# EAGLE design control_board-mixed (EAGLE 8.3.1)
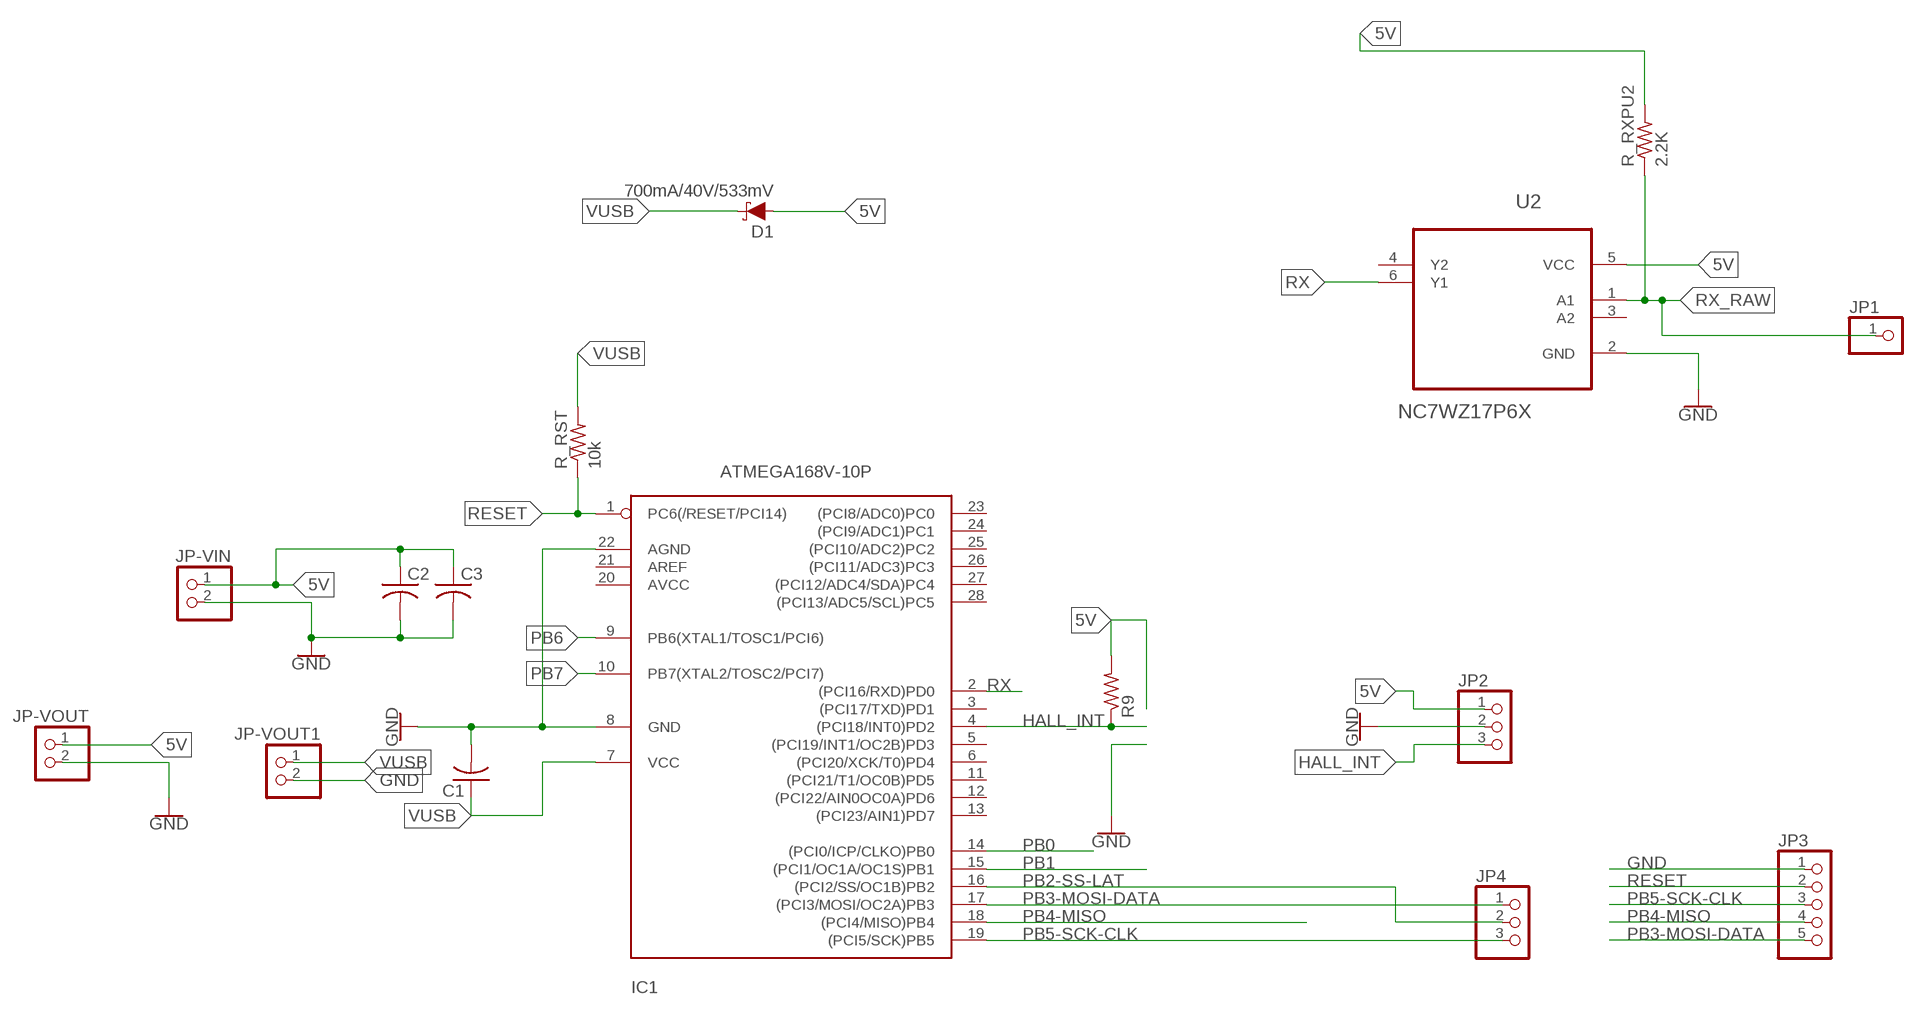
[diagram p0: schematic, sheet 1]

## Parts
C1  C-US025-030X050  [C025-030X050]
C2  C-US025-060X050  [C025-060X050]
C3  C-US025-060X050  [C025-060X050]
D1  700mA/40V/533mV  DIODE-SCHOTTKY-ZLLS500  [SOT23-3]
IC1  ATMEGA168V-10P  [DIL28-3]
JP1  PINHD-1X1  [1X01]
JP2  PINHD-1X3  [1X03]
JP3  PINHD-1X5  [1X05]
JP4  PINHD-1X3  [1X03]
JP-VIN  PINHD-1X2  [1X02]
JP-VOUT  PINHD-1X2  [1X02]
JP-VOUT1  PINHD-1X2  [1X02]
R9  R-US_0207/7  [0207/7]
R_RST  10k  R-US_R0603  [R0603]
R_RXPU2  2.2K  R-US_R0603  [R0603]
U2  NC7WZ17P6X  [SOT65P210X110-6N]

## Nets
5V: C2.1 C3.1 D1.1(A) JP2.1 JP-VIN.1 JP-VOUT.1 R9.2 R_RXPU2.2 U2.5(VCC)
GND: C1.2 C2.2 C3.2 IC1.8(GND) IC1.22(AGND) JP2.2 JP3.1 JP-VIN.2 JP-VOUT1.2 JP-VOUT.2 U2.2(GND)
HALL_INT: IC1.4((PCI18/INT0)PD2) JP2.3 R9.1
PB0: IC1.14((PCI0/ICP/CLKO)PB0)
PB1: IC1.15((PCI1/OC1A/OC1S)PB1)
PB2-SS-LAT: IC1.16((PCI2/SS/OC1B)PB2) JP4.2
PB3-MOSI-DATA: IC1.17((PCI3/MOSI/OC2A)PB3) JP3.5 JP4.1
PB4-MISO: IC1.18((PCI4/MISO)PB4) JP3.4
PB5-SCK-CLK: IC1.19((PCI5/SCK)PB5) JP3.3 JP4.3
PB6: IC1.9(PB6(XTAL1/TOSC1/PCI6))
PB7: IC1.10(PB7(XTAL2/TOSC2/PCI7))
RESET: IC1.1(PC6(/RESET/PCI14)) JP3.2 R_RST.1
RX: IC1.2((PCI16/RXD)PD0) U2.6(Y1)
RX_RAW: JP1.1 R_RXPU2.1 U2.1(A1)
VUSB: C1.1 D1.3(C) IC1.7(VCC) JP-VOUT1.1 R_RST.2
Unconnected: IC1.3((PCI17/TXD)PD1) IC1.5((PCI19/INT1/OC2B)PD3) IC1.6((PCI20/XCK/T0)PD4) IC1.11((PCI21/T1/OC0B)PD5) IC1.12((PCI22/AIN0OC0A)PD6) IC1.13((PCI23/AIN1)PD7) IC1.20(AVCC) IC1.21(AREF) IC1.23((PCI8/ADC0)PC0) IC1.24((PCI9/ADC1)PC1) IC1.25((PCI10/ADC2)PC2) IC1.26((PCI11/ADC3)PC3) IC1.27((PCI12/ADC4/SDA)PC4) IC1.28((PCI13/ADC5/SCL)PC5) U2.3(A2) U2.4(Y2)

## Library data of the parts
C1-C3 = adafruit:C-US: CAPACITOR, American symbol
D1 = SparkFun-DiscreteSemi:DIODE-SCHOTTKY: Schottky diode A Schottky diode is a semiconductor diode which has a low forward voltage drop and a very fast switching action.; PROD_ID: DIO-08411
IC1 = adafruit:ATMEGA168*P: MICROCONTROLLER 16 kBytes FLASH 1 kBytes SRAM 512 Bytes EEPROM USART 8-channel 10 bit ADC
JP1 = pinhead:PINHD-1X1: PIN HEADER
JP2 JP4 = pinhead:PINHD-1X3: PIN HEADER
JP3 = pinhead:PINHD-1X5: PIN HEADER
JP-VIN JP-VOUT JP-VOUT1 = pinhead:PINHD-1X2: PIN HEADER
R9 R_RST R_RXPU2 = adafruit:R-US_: RESISTOR, American symbol
U2 = NC7WZ17P6X:NC7WZ17P6X: Dual Buffer; AVAILABILITY: Good; DESCRIPTION: NC7WZ17 Series 5.5 V TinyLogic UHS Dual Buffer w/ Schmitt Trigger Inputs-SC-70-6; MF: Fairchild Semiconductor; MP: NC7WZ17P6X; PACKAGE: SC-70-6 Fairchild Semiconductor; PRICE: 0.10 USD

## Board
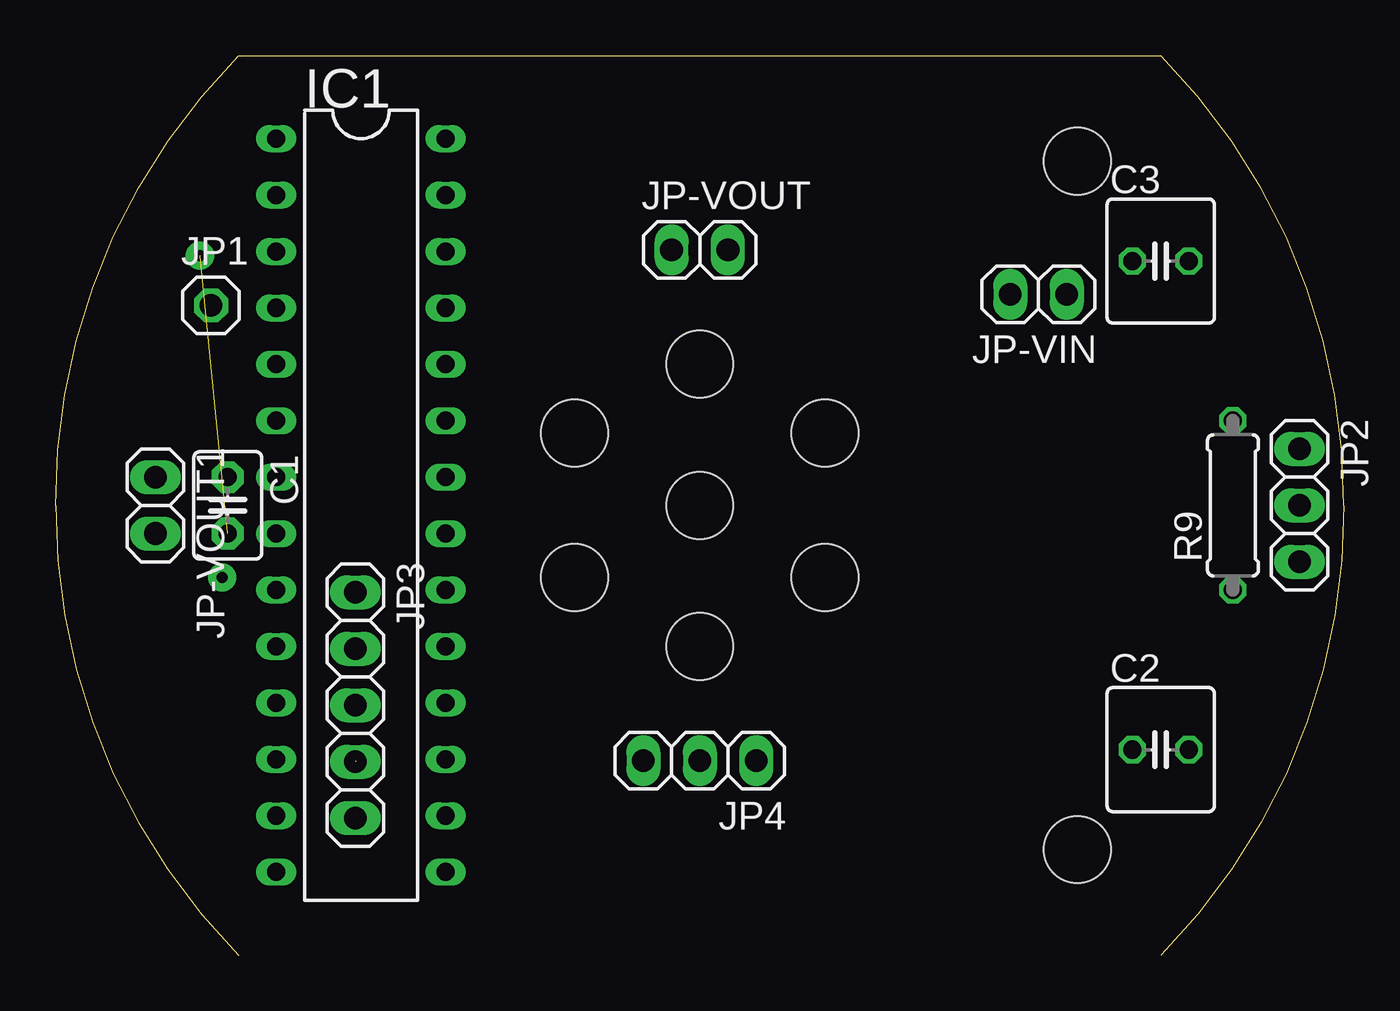
[diagram p1: board, top side]
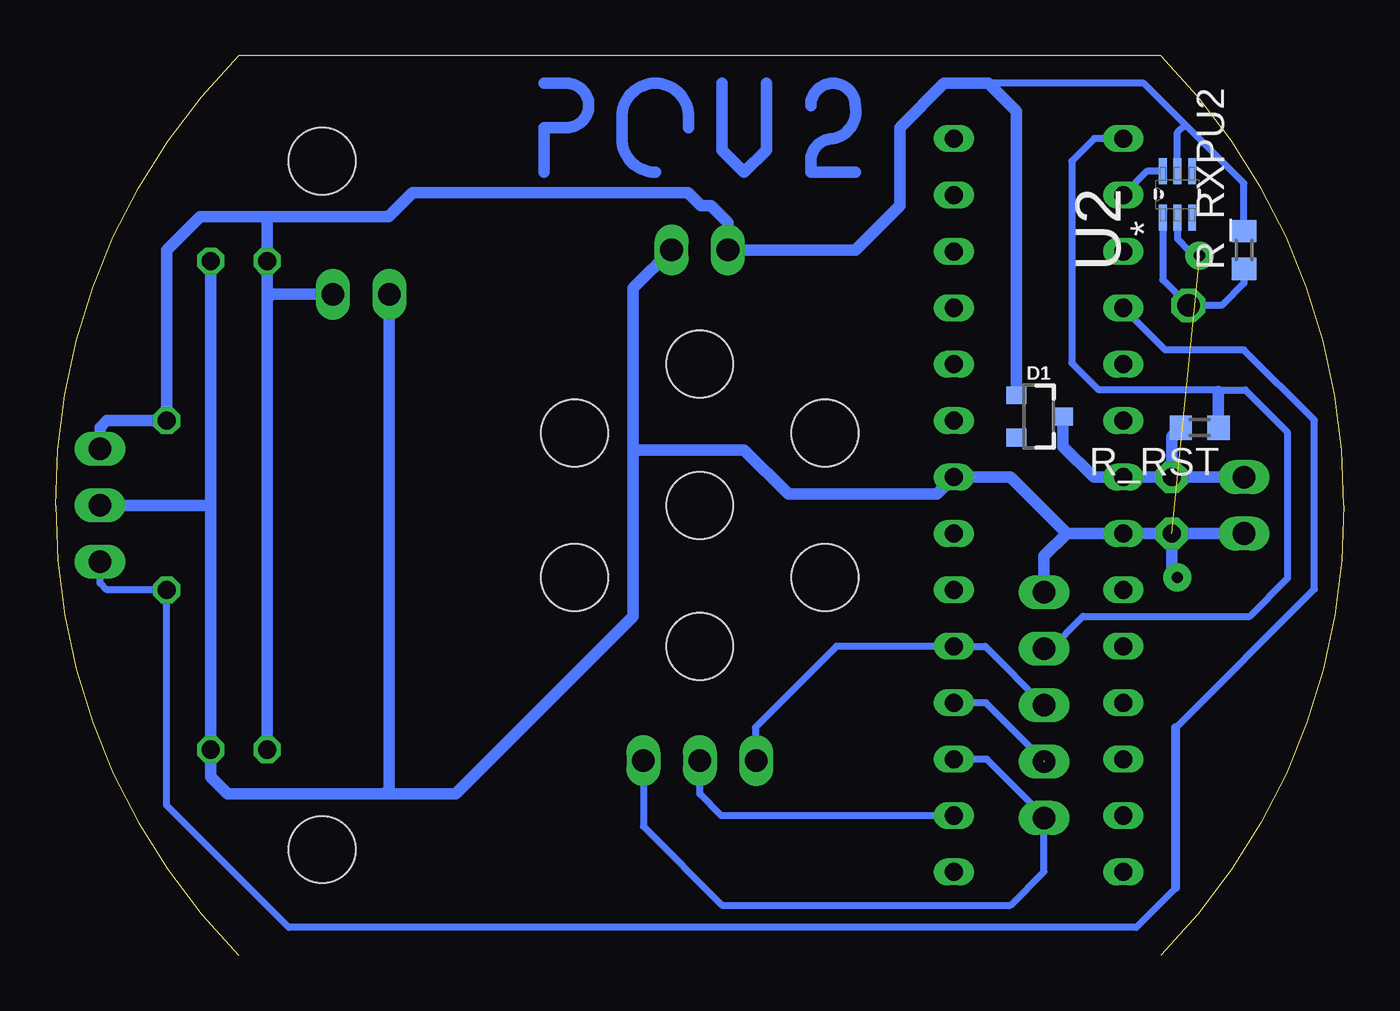
[diagram p2: board, bottom side, seen from below]

Size 58 x 40.5 mm. Coordinates in mm from the lower left corner, seen from the top.
Outline: 8.25,0 arc-45 0,20.25 arc-45 8.25,40.5 49.75,40.5 arc-45 58,20.25 arc-45 49.75,0
Copper layers (1*16): Top 0.035mm / dielectric 1.5mm / Bottom 0.035mm
Design rules "OthermillDRC_1_64_v2": minimum track width 16mil, minimum drill 31mil, track to track 0.39878125mm, track to pad 0.39878125mm, pad to pad 0.39878125mm, via to via 0.39878125mm, smd to smd 0mil, copper to edge 0mil, drill to drill 1mil, minimum pad ring 0mil, minimum via ring 15mil, stop-mask expansion 1mil, vias tented up to drill 30mil, thermal gap 10mil
Holes 3 mm at 29,20.25 29,26.6 34.63,17 23.37,17 46,35.75 46,4.75 29,20.25 29,13.9 23.37,23.5 34.63,23.5

### Footprints (pad centres in the part's own frame; a part is rotated, then mirrored left to right if it is on the bottom)
C025-030X050 = drill 0.813 pad 1.422 octagon: 1 -1.27,0; 2 1.27,0
C025-060X050 = drill 0.813 octagon: 1 -1.27,0; 2 1.27,0
SOT23-3 = smd 0.8 x 0.9: 1 -0.95,-1; 2 0.95,-1; 3 0,1.1
DIL28-3 = drill 0.813 long: 1 -16.51,-3.81; 2 -13.97,-3.81; 3 -11.43,-3.81; 4 -8.89,-3.81; 5 -6.35,-3.81; 6 -3.81,-3.81; 7 -1.27,-3.81; 8 1.27,-3.81; 9 3.81,-3.81; 10 6.35,-3.81; 11 8.89,-3.81; 12 11.43,-3.81; 13 13.97,-3.81; 14 16.51,-3.81; 15 16.51,3.81; 16 13.97,3.81; 17 11.43,3.81; 18 8.89,3.81; 19 6.35,3.81; 20 3.81,3.81; 21 1.27,3.81; 22 -1.27,3.81; 23 -3.81,3.81; 24 -6.35,3.81; 25 -8.89,3.81; 26 -11.43,3.81; 27 -13.97,3.81; 28 -16.51,3.81
1X01 = drill 1.016 octagon: 1 0,0
1X03 = drill 1.016 long: 1 -2.54,0; 2 0,0; 3 2.54,0
1X05 = drill 1.016 long: 1 -5.08,0; 2 -2.54,0; 3 0,0; 4 2.54,0; 5 5.08,0
1X02 = drill 1.016 long: 1 -1.27,0; 2 1.27,0
0207/7 = drill 0.813 octagon: 1 -3.81,0; 2 3.81,0
R0603 = smd 1 x 1.1: 1 -0.85,0; 2 0.85,0
SOT65P210X110-6N = smd 1.168 x 0.356: 1 -1.041,0.66; 2 -1.041,0; 3 -1.041,-0.66; 4 1.041,-0.66; 5 1.041,0; 6 1.041,0.66

### Placement (x,y rotation side)
C1  7.75,20.25 270 top
C2  49.75,9.25 0 top
C3  49.75,31.25 0 top
D1  13.75,24.25 270 bottom
IC1  13.75,20.25 270 top
JP1  7,29.25 0 top
JP2  56,20.25 270 top
JP3  13.5,11.25 270 top
JP4  29,8.75 180 top
JP-VIN  44.25,29.75 180 top
JP-VOUT  29,31.75 0 top
JP-VOUT1  4.5,20.25 270 top
R9  53,20.25 90 top
R_RST  6.5,23.75 180 bottom
R_RXPU2  4.5,31.75 90 bottom
U2  7.5,34.25 90 bottom

### Tracks (layer width: path | path; a pad name or v marks a point on that pad's centre or on a via)
2
  Bottom 0.508: 24,38.25 arc90 23,39.25 arc90 22,38.25 arc90 23,36.75 arc-90 24,35.75 24,35.25 22,35.25
5V
  Bottom 0.305: 16,39.25 9,39.25 7.14,37.39 | R_RXPU2.2 4.5,34.75 7.14,37.39 | U2.5 7.5,37.04 7.14,37.39
  Bottom 0.508: 48.48,29.52 48.48,24.03 | 48.48,29.52 C3.1 48.48,33.23 48.46,33.25 | 48.48,24.03 C2.1 | JP2.1 56,23.75 55.69,24.06 R9.2 53,31.75 51.5,33.25 48.46,33.25 | 48.47,24.02 48.48,24.03 | 48.46,33.25 43,33.25 41.93,34.32 29.52,34.32 28.95,33.75 28.5,33.75 27.73,32.98 JP-VOUT.1 22,31.75 20,33.75 20,37.25 18,39.25 16,39.25 14.75,38 D1.1 | 48.48,29.52 48.25,29.75 JP-VIN.1
GND  (via drill 0.5)  (1 unrouted)
  Bottom 0.305: U2.2 7.5,32.25 7,31.75 6.75,31.75 v6.5,31.5 | JP3.1 13.5,16.25
  Bottom 0.508: C1.2 IC1.8 12.48,18.98 | 12.48,18.98 15.02,21.52 IC1.22 18.33,20.75 25,20.75 27,22.75 32,22.75 | 51.02,20.39 C3.2 | 51.02,20.39 C2.2 51.02,8.02 50.25,7.25 43.47,7.25 | JP2.2 51.16,20.25 51.02,20.39 | 32,22.75 32,30.02 JP-VOUT.2 | 43.47,7.25 43.26,7.25 | 43.26,7.25 40,7.25 32,15.25 32,22.75 | 13.5,16.25 13.5,17.96 12.48,18.98 | 43.23,7.28 43.26,7.25 | JP-VOUT1.2 C1.2 | JP-VIN.2 42.98,7.26 43.47,7.25 | C1.2 7.75,17.25 v7.5,17
HALL_INT
  Bottom 0.305: JP2.3 56,16.75 55.69,16.44 R9.1 53,6.75 47.5,1.25 9.35,1.25 7.57,3.03 | 7.57,10.23 1.33,16.47 1.33,24.08 4.5,27.25 8.05,27.25 IC1.4
  Bottom 0.406: 7.57,3.03 7.57,10.23
O
  Bottom 0.508: 29.5,37.25 29.5,37.75 arc-90 31,39.25 arc-90 32.5,37.75 32.5,36.75 arc-90 31,35.25
P
  Bottom 0.508: 36,35.25 36,37.25 35,37.25 arc-90 34,38.25 arc-90 35,39.25 36,39.25
PB0
  Bottom 0.305: 10.25,3.43 IC1.14
PB2-SS-LAT
  Bottom 0.305: JP4.2 29,7.25 28.03,6.28 25.75,6.28 | IC1.16 25.75,6.28 | 25.75,6.28
PB3-MOSI-DATA
  Bottom 0.305: IC1.17 16.07,8.82 13.5,6.25 | JP4.1 31.54,5.79 28,2.25 15,2.25 13.5,3.75 13.5,6.25 | JP3.5 13.5,6.25
PB4-MISO  (1 unrouted)
  Bottom 0.305: IC1.18 16.11,11.36 13.5,8.75
PB5-SCK-CLK
  Bottom 0.305: JP3.3 16.15,13.9 IC1.19 22.85,13.9 26.5,10.25 26.5,8.79 JP4.3
RESET
  Bottom 0.305: IC1.1 11.24,36.76 12.25,35.75 12.25,26.66 11.03,25.44 5.57,25.44 | 5.57,25.44 4.44,25.44 2.53,23.53 2.53,16.97 4.25,15.25 11.75,15.25 13.25,13.75 13.5,13.75 JP3.2 | 5.65,25.36 5.57,25.44
  Bottom 0.508: R_RST.1 5.65,25.36
RX
  Bottom 0.305: U2.6 8.87,35.29 IC1.2
RX_RAW
  Bottom 0.305: U2.1 8.16,30.41 JP1.1 5.5,29.25 4.5,30.25 R_RXPU2.1
V
  Bottom 0.508: 28,39.25 28,36.25 27,35.25 26,36.25 26,39.25
VUSB
  Bottom 0.508: C1.1 IC1.7 11.27,21.52 12.65,22.9 D1.3 | JP-VOUT1.1 C1.1 | C1.1 7.75,23.35 R_RST.2